# EAGLE design SparkFun_Mini_GPS_Shield (EAGLE 7.6.0)
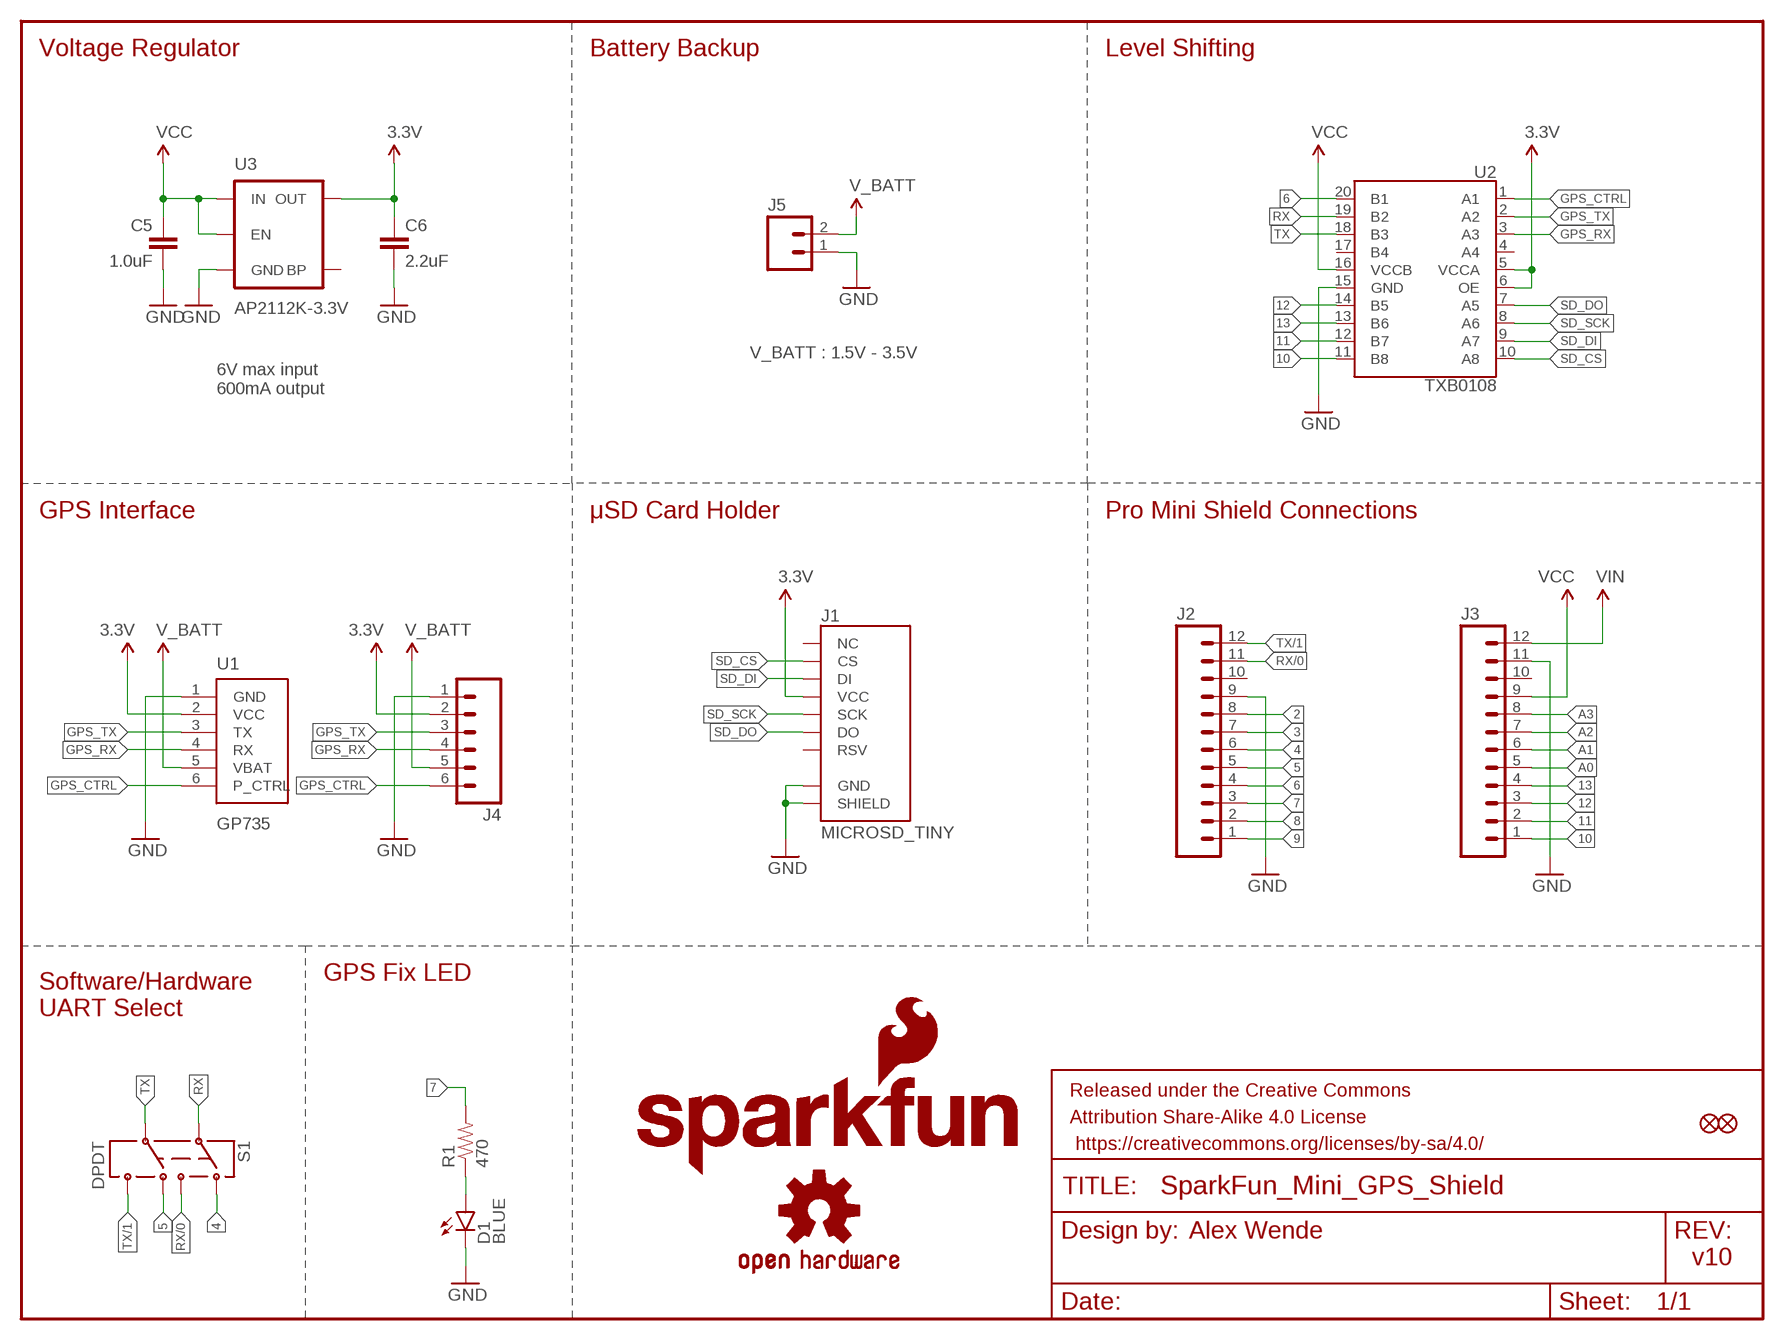
[diagram p0: schematic, sheet 1]

## Parts
C5  1.0uF  1.0UF-25V-+80/-20(0805)"  [0805-CAP]
C6  2.2uF  2.2UF-10V-20%(0603)  [0603-CAP]
D1  BLUE  LED-BLUE0603  [LED-0603]
FD1  FIDUCIALUFIDUCIAL  [MICRO-FIDUCIAL]
FD2  FIDUCIALUFIDUCIAL  [MICRO-FIDUCIAL]
FRAME1  FRAME-LETTER  [CREATIVE_COMMONS]
J1  MICROSD_TINY  [MICROSD_TINY]
J2  M12NO_SILK  [1X12_NO_SILK]
J3  M12NO_SILK  [1X12_NO_SILK]
J4  M06NO_SILK_FEMALE_PTH  [1X06_NO_SILK]
J5  M021X02_NO_SILK  [1X02_NO_SILK]
LOGO1  OSHW-LOGOS  [OSHW-LOGO-S]
LOGO3  SFE_LOGO_FLAME.1_INCH  [SFE_LOGO_FLAME_.1]
LOGO4  SFE_LOGO_NAME.1_INCH  [SFE_LOGO_NAME_.1]
R1  470  470OHM1/10W1%(0603)  [0603-RES]
S1  DPDT  SWITCH-DPDTAYZ0202  [AYZ0202]
U1  GP735  [GP735]
U2  TXB0108  [UFDFN-20]
U3  AP2112K-3.3V  V_REG_LDOSMD  [SOT23-5]

## Nets
2: J2.8
3: J2.7
3.3V: C6.1 J1.4(VCC) J4.2 U1.2(VCC) U2.5(VCCA) U2.6(OE) U3.5(OUT)
4: J2.6 S1.1
5: J2.5 S1.4
6: J2.4 U2.20(B1)
7: J2.3 R1.2
8: J2.2
9: J2.1
10: J3.1 U2.11(B8)
11: J3.2 U2.12(B7)
12: J3.3 U2.14(B5)
13: J3.4 U2.13(B6)
A0: J3.5
A1: J3.6
A2: J3.7
A3: J3.8
GND: C5.2 C6.2 D1.C J1.6(GND) J1.GND1(SHIELD) J1.GND2(SHIELD) J1.GND3(SHIELD) J1.GND4(SHIELD) J1.GND5(SHIELD) J1.GND6(SHIELD) J2.9 J3.11 J4.1 J5.1 U1.1(GND) U2.15(GND) U3.2(GND)
GPS_CTRL: J4.6 U1.6(P_CTRL) U2.1(A1)
GPS_RX: J4.4 U1.4(RX) U2.3(A3)
GPS_TX: J4.3 U1.3(TX) U2.2(A2)
N$1: D1.A R1.1
RX: S1.2 U2.19(B2)
RX/0: J2.11 S1.3
SD_CS: J1.2(CS) U2.10(A8)
SD_DI: J1.3(DI) U2.9(A7)
SD_DO: J1.7(DO) U2.7(A5)
SD_SCK: J1.5(SCK) U2.8(A6)
TX: S1.5 U2.18(B3)
TX/1: J2.12 S1.6
V_BATT: J4.5 J5.2 U1.5(VBAT)
VCC: C5.1 J3.9 U2.16(VCCB) U3.1(IN) U3.3(EN)
VIN: J3.12
Unconnected: J1.1(RSV) J1.8(RSV) J1.9(NC) J2.10 J3.10 U2.4(A4) U2.17(B4) U3.4(BP)

## Notes on the sheet
- Voltage Regulator | Battery Backup | Level Shifting
- V_BATT : 1.5V - 3.5V
- 6V max input
  600mA output
- GPS Interface | μSD Card Holder | Pro Mini Shield Connections
- GPS Fix LED
- Software/Hardware
  UART Select
- Alex Wende
- v10

## Library data of the parts
C5 = SparkFun-Capacitors:1.0UF-25V-+80/-20(0805): CAP-11625; PROD_ID: CAP-11625
C6 = SparkFun-Capacitors:2.2UF-10V-20%(0603): CAP-07888; PROD_ID: CAP-07888
D1 = SparkFun-LED:LED-BLUE: Blue LEDs for production use Various blue LEDs stocked by SparkFun production 0603 - DIO-08575 Rebel - DIO-09553 1206 - DIO-09911; PROD_ID: DIO-08575
FD1 FD2 = SparkFun-Aesthetics:FIDUCIAL: Fiducial Alignment Points Various fiducial points for machine vision alignment.
FRAME1 = SparkFun-Aesthetics:FRAME-LETTER: Schematic Frame Standard 8.5x11 US Letter frame
J1 = GPS_Pro_Mini_temp:MICROSD_TINY; PROD_ID: CONN-13500
J2 J3 = SparkFun-Connectors:M12: Header 12 Standard 12-pin 0.1" header. Use with straight break away headers (SKU : PRT-00116), right angle break away headers (PRT-00553), swiss pins (PRT-00743), machine pins (PRT-00117), and female headers (PRT-00115).
J4 = SparkFun-Connectors:M06: Header 6 Standard 6-pin 0.1" header. Use with straight break away headers (SKU : PRT-00116), right angle break away headers (PRT-00553), swiss pins (PRT-00743), machine pins (PRT-00117), and female headers (PRT-00115). Molex polarized connector foot print use with SKU : PRT-08094 with associated crimp pins and housings. NOTES ON THE VARIANTS LOCK and LOCK_LONGPADS... This footprint was designed to help hold the alignment of a through-hole component (i.e. 6-pin header) while soldering it into place. You may notice that each hole has been shifted either up or down by 0.005 of an inch from it's more standard position (which is a perfectly straight line). This slight alteration caused the pins (the squares in the middle) to touch the edges of the holes. Because they are alternating, it causes a "brace" to hold the component in place. 0.005 has proven to be the perfect amount of "off-center" position when using our standard breakaway headers. Although looks a little odd when you look at the bare footprint, once you have a header in there, the alteration is very hard to notice. Also,if you push a header all the way into place, it is covered up entirely on the bottom side. This idea of altering the position of holes to aid alignment will be further integrated into the Sparkfun Library for other footprints. It can help hold any component with 3 or more connection pins.; PROD_ID: CONN-08437
J5 = SparkFun-Connectors:M02: Standard 2-pin 0.1" header. Use with - straight break away headers ( PRT-00116) - right angle break away headers (PRT-00553) - swiss pins (PRT-00743) - machine pins (PRT-00117) - female headers (PRT-00115) Molex polarized connector foot print use with: PRT-08233 with associated crimp pins and housings. 2.54_SCREWTERM for use with PRT-10571. 3.5mm Screw Terminal footprints for PRT-08084 5mm Screw Terminal footprints for use with PRT-08432
LOGO1 = SparkFun-Aesthetics:OSHW-LOGO: Open Source Hardware Logo This logo indicates the piece of hardware it is found on incorporates a OSHW license and/or adheres to the definition of open source hardware found here: http://freedomdefined.org/OSHW
LOGO3 = SparkFun-Aesthetics:SFE_LOGO_FLAME: SFE Logo, flame only This is the SparkFun flame logo. The logo on the schematic will always be the same size; the package variant is the height of the flame. Default layer for the logo on the board is tSilk.
LOGO4 = SparkFun-Aesthetics:SFE_LOGO_NAME: SFE Logo, name only This is the SparkFun name logo. The logo on the schematic will always be the same size; the package variant is the height of the flame part of the logo (or the height the flame would be, if it were drawn). Default layer for the logo on the board is tSilk.
R1 = SparkFun-Resistors:470OHM1/10W1%(0603): RES-07869; PROD_ID: RES-07869
S1 = SparkFun-Electromechanical:SWITCH-DPDT: DPDT Version of the COM-00597; PROD_ID: SWCH-08179
U1 = GPS_Pro_Mini_temp:GP735; PROD_ID: CONN-08249
U2 = SparkFun-DigitalIC:TXB0108: 8-Bit Bi-Directional Level Shifter 1.2V-3.6V (VCCA) to 1.65V-5.5V (VCCB) bi-directional level shifter with auto direction sensing. Max data rate - VCCA 1.2V: 20Mbps (50ns), VCCA 3.3V: 100Mbps (10ns) Digikey: 296-27217-1-ND (20-UFDFN) IC-12292; PROD_ID: IC-12292
U3 = SparkFun-PowerIC:V_REG_LDO: Voltage Regulator LDO Standard 150mA LDO voltage regulator in SOT-23 layout. Micrel part MIC5205. BP (by-pass) pin is used to lower output noise with 470pF cap.; PROD_ID: VREG-12457

## Board
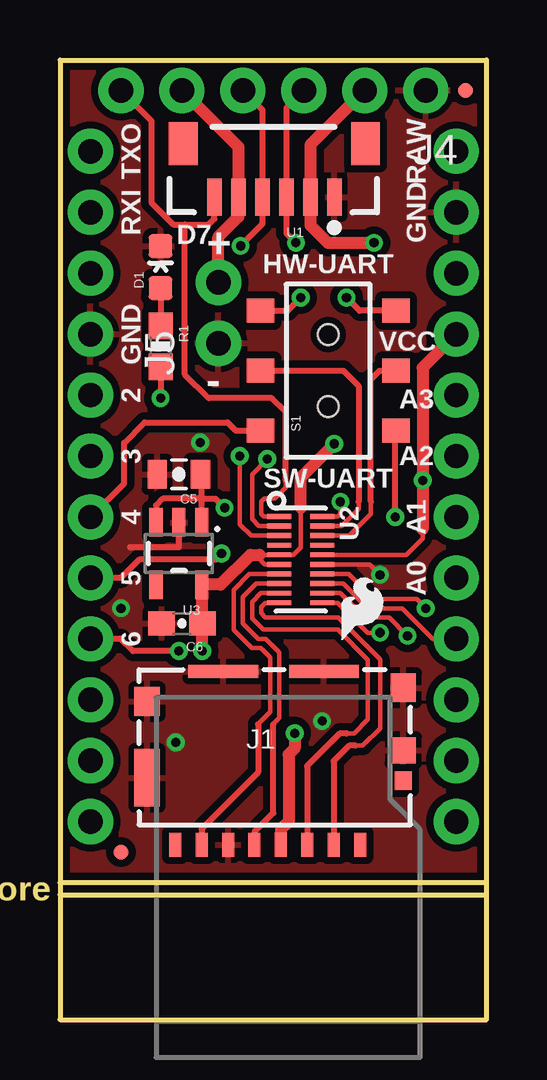
[diagram p1: board, top side]
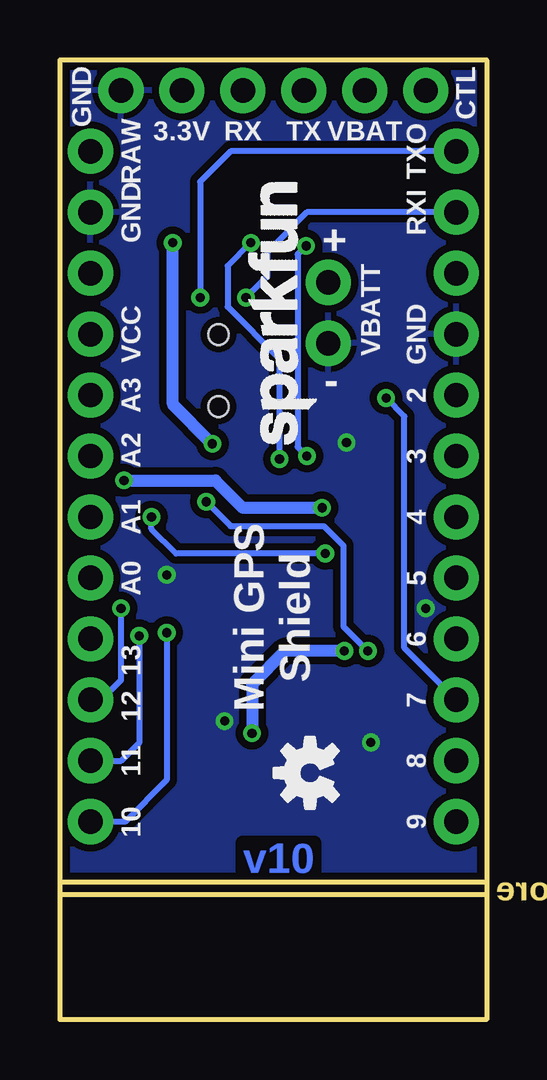
[diagram p2: board, bottom side, seen from below]

Size 17.78 x 40.01 mm. Coordinates in mm from the lower left corner, seen from the top.
Outline: 0,5.71 17.78,5.71
Outline: 17.78,5.71 17.78,40.01 0,40.01 0,5.71
Outline: 0,5.21 0,0 17.78,0 17.78,5.21
Outline: 0,5.71 0,5.21
Outline: 0,5.21 17.78,5.21
Outline: 17.78,5.21 17.78,5.71
Copper layers (1*16): Top 0.035mm / dielectric 1.5mm / Bottom 0.035mm
Design rules "SparkFun-2-layer-TIGHT": minimum track width 7mil, minimum drill 15mil, track to track 7mil, track to pad 7mil, pad to pad 7mil, via to via 7mil, smd to smd 7mil, copper to edge 7mil, drill to drill 7mil, minimum pad ring 7mil, minimum via ring 7mil, stop-mask expansion 4mil, vias tented up to drill 25mil, thermal gap 10mil

### Footprints (pad centres in the part's own frame; a part is rotated, then mirrored left to right if it is on the bottom)
0805-CAP = smd 0.8 x 1.2: 1 -0.9,0; 2 0.9,0
0603-CAP = smd 1.1 x 1: 1 -0.85,0; 2 0.85,0
LED-0603 = smd 1 x 1: A 0,-0.877; C 0,0.877
MICRO-FIDUCIAL = smd 0.635 x 0.635: 1 0,0
MICROSD_TINY = smd 0.5 x 1: 1 9.2,-0.85; 2 8.1,-0.85; 3 7,-0.85; 4 5.9,-0.85; 5 4.8,-0.85; 6 3.7,-0.85; 7 2.6,-0.85; 8 1.5,-0.85 | smd 0.72 x 0.78: 9 11,1.83 | smd 1.05 x 1.08: GND1 11,3.1 | smd 1.05 x 1.2: GND2 11,5.71; GND3 0.325,5.14 | smd 1.05 x 2.39: GND4 0.325,1.955 | smd 2.91 x 0.55: GND5 3.505,6.385; GND6 7.695,6.385
1X12_NO_SILK = drill 1.016 pad 1.88: 1 0,0; 2 2.54,0; 3 5.08,0; 4 7.62,0; 5 10.16,0; 6 12.7,0; 7 15.24,0; 8 17.78,0; 9 20.32,0; 10 22.86,0; 11 25.4,0; 12 27.94,0
1X06_NO_SILK = drill 1.016 pad 1.88: 1 0,0; 2 2.54,0; 3 5.08,0; 4 7.62,0; 5 10.16,0; 6 12.7,0
1X02_NO_SILK = drill 1.016 pad 1.88: 1 0,0; 2 2.54,0
0603-RES = smd 1.1 x 1: 1 -0.85,0; 2 0.85,0
AYZ0202 = smd 1 x 1.15: 1 -2.5,2.825; 2 0,2.825; 3 2.5,2.825; 4 -2.5,-2.825; 5 0,-2.825; 6 2.5,-2.825 | hole 0.85: 1.5,0; -1.5,0
GP735 = smd 0.6 x 1.55: 1 0,0; 2 -1,0; 3 -2,0; 4 -3,0; 5 -4,0; 6 -5,0 | smd 1.2 x 1.8: P$1 1.3,2.225; P$2 -6.3,2.225
UFDFN-20 = smd 0.2 x 1: 1 -1.8,-0.9; 2 -1.4,-0.9; 3 -1,-0.9; 4 -0.6,-0.9; 5 -0.2,-0.9; 6 0.2,-0.9; 7 0.6,-0.9; 8 1,-0.9; 9 1.4,-0.9; 10 1.8,-0.9; 11 1.8,0.9; 12 1.4,0.9; 13 1,0.9; 14 0.6,0.9; 15 0.2,0.9; 16 -0.2,0.9; 17 -0.6,0.9; 18 -1,0.9; 19 -1.4,0.9; 20 -1.8,0.9
SOT23-5 = smd 0.55 x 1.2: 1 -0.95,-1.3; 2 0,-1.3; 3 0.95,-1.3; 4 0.95,1.3; 5 -0.95,1.3

### Placement (x,y rotation side)
C5  4.95,22.73 180 top
C6  5.08,16.51 180 top
D1  4.19,31.37 0 top
FD1  2.54,6.99 0 top
FD2  16.89,38.73 0 top
FRAME1  -23.7,-17.37 0 top  (outside the outline)
J1  3.3,8.13 0 top
J2  1.27,8.26 90 top
J3  16.51,8.26 90 top
J4  15.24,38.73 180 top
J5  6.6,28.19 90 top
LOGO1  7.37,10.29 90 bottom
LOGO3  11.43,15.49 0 top
LOGO4  6.6,23.5 90 bottom
R1  4.19,28.07 270 top
S1  11.18,27.05 90 top
U1  11.43,34.29 0 top
U2  10.03,19.18 270 top
U3  4.95,19.43 180 top

### Tracks (layer width: path | path; a pad name or v marks a point on that pad's centre or on a via)
3.3V  (via drill 0.38)
  Top 0.178: 10.03,21.34 10.03,19.69 9.72,19.38 U2.5 8.38,19.38 | 8.38,19.38 8.31,19.38 | U2.6 8.53,18.98 8.38,19.12 8.38,19.38
  Top 0.508: J4.2 10.43,36.47 U1.2 10.43,33.11 11.16,32.38 v13.08,32.38 | v9.78,11.94 9.78,11.3 9.53,11.05 9.53,8.26 9.2,7.93 J1.4 | v11.43,24 10.03,22.61 10.03,21.34 | 8.31,19.38 7.93,19.38 6.68,18.13 U3.5 5.9,16.51 C6.1 v5.93,15.37
  Bottom 0.508: v11.43,24 13.08,25.65 v13.08,32.38 | v5.93,15.37 8.4,15.37 9.78,13.99 v9.78,11.94
4
  Top 0.254: J2.6 2.67,22.35 2.67,24.04 3.52,24.89 6.99,24.89 7.33,24.55 S1.1
5  (via drill 0.38)
  Top 0.254: v13.97,20.95 13.97,24.52 S1.4 | J2.5 2.54,18.41 3.3,19.18 6.48,19.18 v6.73,19.43
  Bottom 0.254: v6.73,19.43 12.95,19.43 13.97,20.45 v13.97,20.95
6  (via drill 0.38)
  Top 0.178: v11.68,21.59 11.68,21.08 11.58,20.98 U2.20
  Top 0.254: v4.95,15.37 3.05,15.37 2.54,15.88 J2.4
  Bottom 0.254: v11.68,21.59 10.67,20.57 6.78,20.57 5.97,19.76 5.97,16.38 v4.95,15.37
7  (via drill 0.38)
  Top 0.254: R1.2 v4.19,25.91
  Bottom 0.254: J2.3 3.43,15.49 3.43,25.15 v4.19,25.91
10  (via drill 0.38)
  Top 0.178: U2.11 11.58,17.38 12.83,16.13 v13.34,16.13
  Bottom 0.254: J3.1 15.07,8.26 13.34,9.99 v13.34,16.13
11  (via drill 0.38)
  Top 0.178: U2.12 11.69,17.78 12.7,16.76 13.72,16.76 v14.48,16
  Bottom 0.254: v14.48,16 14.48,11.54 15.22,10.79 J3.2
12  (via drill 0.38)
  Top 0.178: U2.14 12.03,18.58 13.08,17.53 14.86,17.53 v15.24,17.14
  Bottom 0.254: v15.24,17.14 15.24,14.15 16.05,13.34 J3.3
13
  Top 0.178: J3.4 15.53,15.88 14.26,17.14 12.83,17.14 11.79,18.18 U2.13
GND  (via drill 0.38)
  Top 0.178: U2.15 12.9,18.98 v13.34,18.54
  Top 0.254: U3.2 4.95,19.68 2.92,19.68
  other vias: 4.83,11.56 10.92,12.45 5.84,24.05 2.54,17.14
  pour Top (isolate 0.305): 0,40.01 0,5.71 17.78,5.71 17.78,40.01
  pour Bottom (isolate 0.305): 17.78,40.01 17.78,5.71 0,5.71 0,40.01
GPS_CTRL
  Top 0.178: 9.4,22.48 9.4,22.18 8.94,21.72 8.51,21.72 8.38,21.59 8.38,21.08 8.49,20.98 U2.1
  Top 0.254: J4.6 3.81,37.47 3.81,34.06 4.73,33.15 5.21,33.15 | 5.21,33.15 6.19,33.15 6.43,33.39 U1.6 | 9.4,22.48 9.4,25.34 8.83,25.91 6.2,25.91 5.21,26.9 5.21,33.15
GPS_RX  (via drill 0.38)
  Top 0.178: U2.3 7.96,20.18 7.49,20.64 v7.49,23.5
  Top 0.254: J4.4 8.43,37.92 U1.4 8.43,33.16 v7.53,32.26
  Bottom 0.254: v7.53,32.26 7.87,31.91 7.87,23.88 v7.49,23.5
GPS_TX  (via drill 0.38)
  Top 0.178: U2.2 8.28,20.58 8,20.86 8,22.73 v8.64,23.37
  Top 0.254: J4.3 9.43,38.01 U1.3 9.43,32.78 v9.83,32.38
  Bottom 0.254: v9.83,32.38 10.79,31.42 10.79,29.72 8.64,27.56 v8.64,23.37
N$1
  Top 0.254: D1.A R1.1
RX
  Top 0.178: U2.19 11.73,20.58 12.45,21.29 12.45,21.59
  Top 0.254: S1.2 11.81,27.05 12.45,26.42 12.45,21.59
RX/0  (via drill 0.38)
  Top 0.254: S1.3 9.48,29.55 v10.03,30.1
  Bottom 0.254: J2.11 7.49,33.66 9.14,32 9.14,30.99 v10.03,30.1
SD_CS
  Top 0.178: 12.32,11.43 12.62,11.43 13.34,12.15 13.34,15.02 11.59,16.76 8.56,16.76 8.38,16.94 8.38,17.21 8.55,17.38 U2.10
  Top 0.254: 12.32,11.43 12.05,11.43 11.4,10.78 J1.2
SD_DI
  Top 0.178: U2.9 8.36,17.78 8,17.42 8,16.71 8.46,16.26 11.57,16.26 12.83,15 12.83,12.51 12.26,11.94 11.94,11.94
  Top 0.254: J1.3 10.3,10.57 11.66,11.93 11.94,11.93 11.94,11.94
SD_DO
  Top 0.178: U2.7 7.9,18.58 7.24,17.92 7.24,16.23 7.98,15.49 8.36,15.49 8.76,15.09 8.76,12.83 8.26,12.32
  Top 0.254: J1.7 5.9,7.95 8.26,10.3 8.26,12.32
SD_SCK
  Top 0.178: 8.89,12.32 9.14,12.57 9.14,15.31 8.58,15.88 8.26,15.88 7.62,16.51 7.62,17.63 8.17,18.18 U2.8
  Top 0.254: 8.89,12.32 8.89,8.61 8.1,7.82 J1.5
TX
  Top 0.178: U2.18 12.04,20.18 12.95,21.09 12.95,21.59
  Top 0.254: 12.95,21.59 12.95,26.69 13.31,27.05 S1.5
TX/1  (via drill 0.38)
  Top 0.254: S1.6 12.49,29.55 v11.94,30.1
  Bottom 0.254: J2.12 10.67,36.2 11.94,34.92 v11.94,30.1
V_BATT
  Top 0.508: J4.5 7.43,36.38 U1.5 7.43,33.47 6.6,32.64 J5.2
VCC  (via drill 0.38)
  Top 0.178: U2.16 14.43,19.38 15.11,20.06 15.11,20.45
  Top 0.254: U3.1 5.9,21.72 | 5.9,21.72 5.9,22.73 C5.1 | 5.9,21.72 4.29,21.72 4,21.43 U3.3 | 5.9,21.72 6.48,21.72 v6.86,21.34
  Top 0.508: J3.9 15.11,27.18 v15.11,22.48 15.11,20.45
  Bottom 0.508: v15.11,22.48 11.3,22.48 10.16,21.34 v6.86,21.34

### Text on the board
Bottom: v10
Dimension: V-score
tPlace: TXO | RAW | RXI | GND | D7 | + | HW-UART | GND | VCC | 2 | - | A3 | 3 | SW-UART | A2 | 4 | A1 | 5 | A0 | 6
bPlace: CTL | GND | VBAT | TX | RX | 3.3V | TXO | RAW | RXI | GND | + | VBATT | GND | VCC | 2 | - | A3 | A2 | 3 | 4 | A1 | 5 | A0 | Mini GPS / Shield | 6 | 13 | 7 | 12 | 8 | 11 | 9 | 10
Measures: Units are in Inches
tDocu: PCB thickness = 0.032" | Alex Wende